# EAGLE design GPSClock (EAGLE 7.7.0)
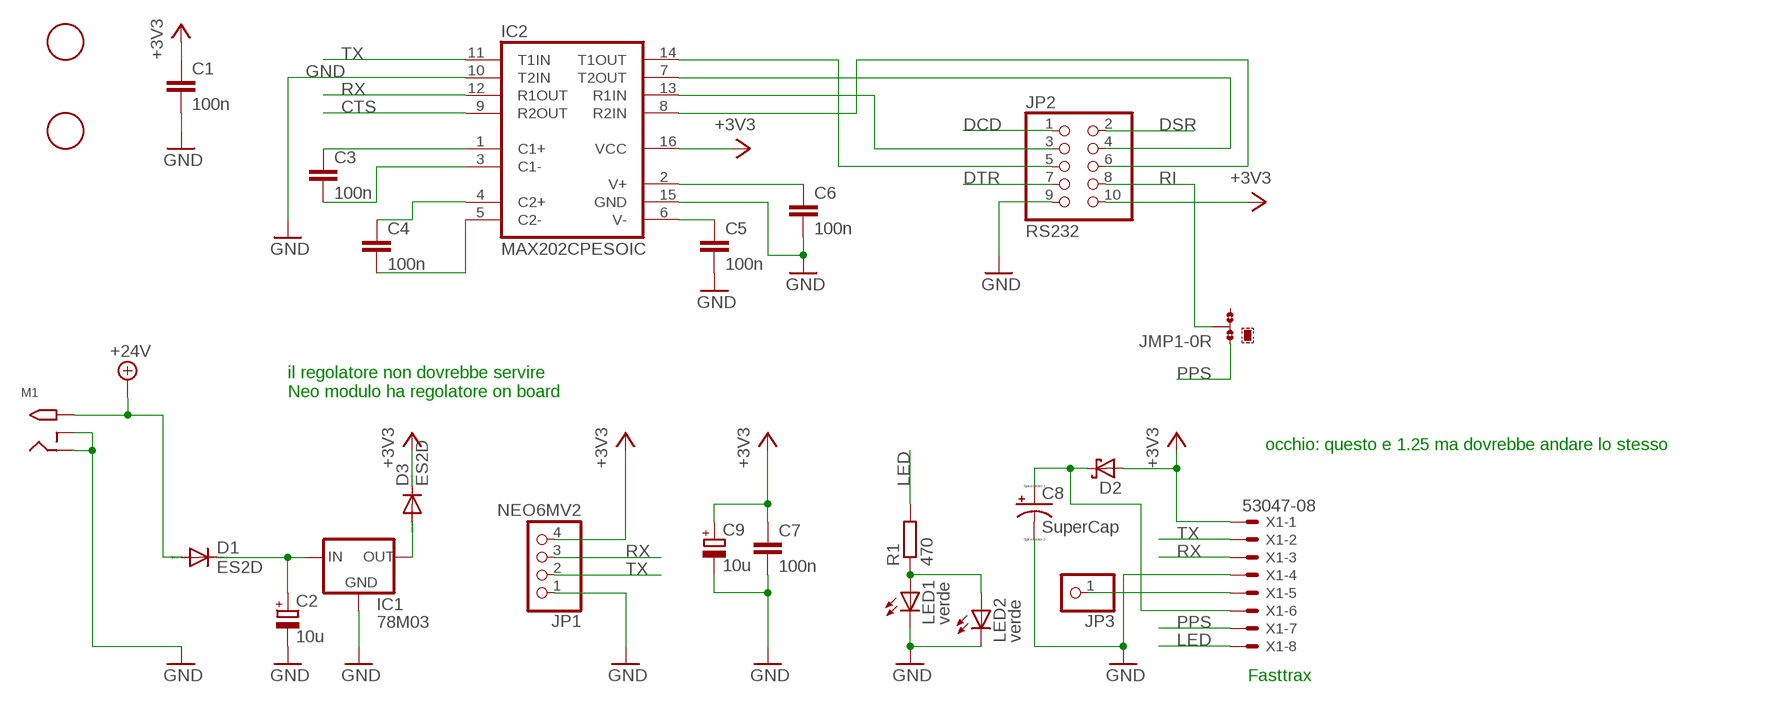
[diagram p0: schematic, sheet 1]

## Parts
C1  100n  C-EUC0805  [C0805]
C2  10u  CPOL-EUSMCD  [SMC_D]
C3  100n  C-EUC0805  [C0805]
C4  100n  C-EUC0805  [C0805]
C5  100n  C-EUC0805  [C0805]
C6  100n  C-EUC0805  [C0805]
C7  100n  C-EUC0805  [C0805]
C8  SuperCap  CPOL-USE10-22.5  [EB22,5D]
C9  10u  CPOL-EUSMCC  [SMC_C]
D1  ES2D  [SMB]
D2  SCHOTTKY-DIODESMC  [SMC]
D3  ES2D  [SMB]
F2  FIDUCIAL  [FIDUCIAL_1MM]
F3  FIDUCIAL  [FIDUCIAL_1MM]
IC1  78M03  78MXXSDPACK  [DPACK]
IC2  MAX202CPESOIC  [SO16]
JMP1  0R-JUMPC  [C0R-JMP]
JP1  NEO6MV2  PINHD-1X4  [1X04]
JP2  RS232  PINHD-2X05_2.54  [2X05]
JP3  PINHD-1X1  [1X01]
LED1  verde  LEDCHIPLED_0805  [CHIPLED_0805]
LED2  verde  LED3MM  [LED3MM]
M1  2.1MMJACKTHM  [PJ-102A]
R1  470  R-EU_R0805  [R0805]
X1  53047-08  [53047-08]

## Nets
+3V3 [+3V3]: C1.1 C7.1 C9.+ D2.A D3.C IC2.16(VCC) JP1.4 JP2.10 X1.1
+24V [+3V3]: D1.A M1.TIP
CTS: IC2.9(R2OUT)
DCD: JP2.1
DSR: JP2.2
DTR: JP2.7
GND [GND]: C1.2 C2.- C5.2 C6.2 C7.2 C8.- C9.- IC1.4(GND) IC2.10(T2IN) IC2.15(GND) JP1.1 JP2.9 LED1.C LED2.K(C) M1.RING M1.RING_SW X1.4
LED: R1.2 X1.8
N$1: JP3.1 X1.5
N$2: C3.1 IC2.1(C1+)
N$3 [+3V3]: D3.A IC1.3(OUT)
N$4: C3.2 IC2.3(C1-)
N$5 [+3V3]: C8.+ D2.C X1.6
N$6 [+3V3]: C2.+ D1.C IC1.1(IN)
N$9: LED1.A LED2.A R1.1
N$16: C4.1 IC2.4(C2+)
N$27: C4.2 IC2.5(C2-)
N$39: IC2.14(T1OUT) JP2.5
N$40: IC2.7(T2OUT) JP2.4
N$46: IC2.13(R1IN) JP2.3
N$47: IC2.8(R2IN) JP2.6
PPS: JMP1.1 X1.7
RI: JMP1.2 JP2.8
RX: IC2.12(R1OUT) JP1.3 X1.3
TX: IC2.11(T1IN) JP1.2 X1.2
V+: C6.1 IC2.2(V+)
V-: C5.1 IC2.6(V-)
Unconnected: JMP1.3

## Notes on the sheet
- il regolatore non dovrebbe servire
  Neo modulo ha regolatore on board
- occhio: questo e 1.25 ma dovrebbe andare lo stesso
- Fasttrax

## Library data of the parts
C1 C3-C7 = resistor:C-EU: CAPACITOR, European symbol
C2 C9 = resistor:CPOL-EU: POLARIZED CAPACITOR, European symbol
C8 = resistor:CPOL-US: POLARIZED CAPACITOR, American symbol
D1 D3 = diode:ES2D: DIODE super fast rectifier, 2 A
D2 = diode:SCHOTTKY-DIODE: Schottky Diode
F2 F3 = adafruit:FIDUCIAL: For use by pick and place machines to calibrate the vision/machine, 1mm By microbuilder.eu
IC1 = v-reg:78MXXS: VOLTAGE REGULATOR
IC2 = maxim:MAX202CPE: RS232 TRANSCEIVER
JMP1 = jump-0r-smd:0R-JUMP: SMD 0R 0805 Jumper
JP1 = pinhead:PINHD-1X4: PIN HEADER
JP2 = pinhead-2:PINHD-2X05: PIN HEADER
JP3 = pinhead:PINHD-1X1: PIN HEADER
LED1 = led:LED: LED
LED2 = adafruit:LED: LED
M1 = adafruit:2.1MMJACK: 2.1mm x 5.5mm THM DC jack with internal switch. Digikey part #PJ-102A, 4UCON part #05537 2.1mm x 5.5mm SMT DC jack with internal switch. Digikey part #PJ-002A-SMT, 4UCON part #03267 By microbuilder.eu & adafruit.com
R1 = resistor:R-EU_: RESISTOR, European symbol
X1 = con-molex:53?-08: CONNECTOR wire to board 1.25 mm (.049 inch) pitch header; MPN: 53047-0810; OC_FARNELL: 1012258; OC_NEWARK: 98K9826

## Net classes
1 +3V3: width 0.508 mm, clearance 0.152 mm
2 N2: width 0.762 mm, clearance 0.762 mm
3 N3: width 0.508 mm
4 GND: width 0.508 mm, clearance 0.152 mm

## Board
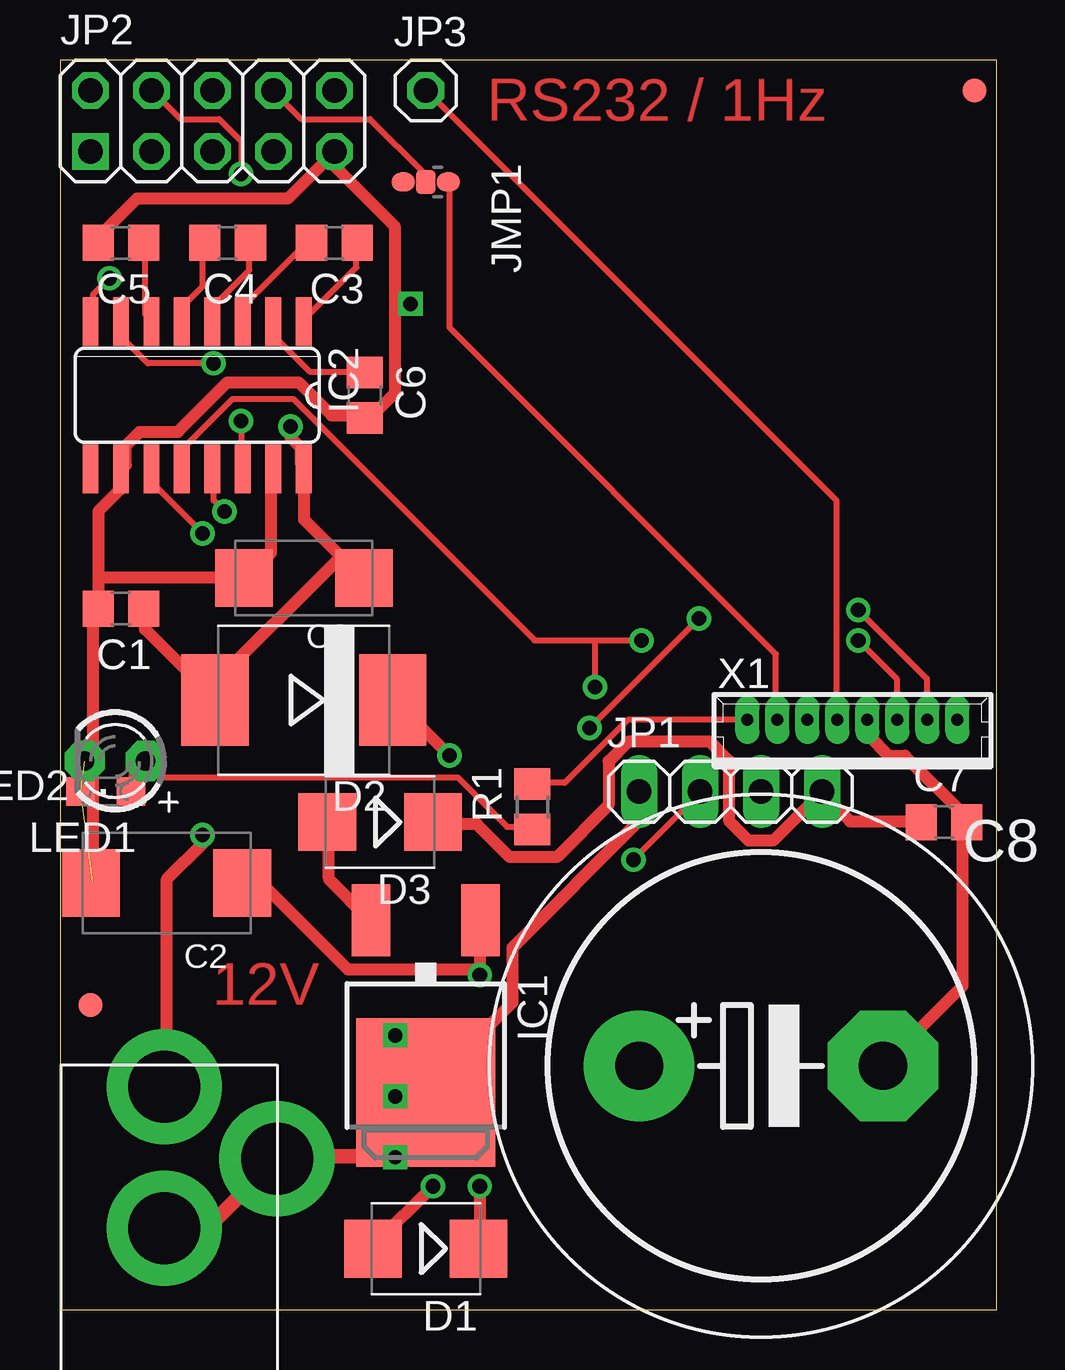
[diagram p1: board, top side]
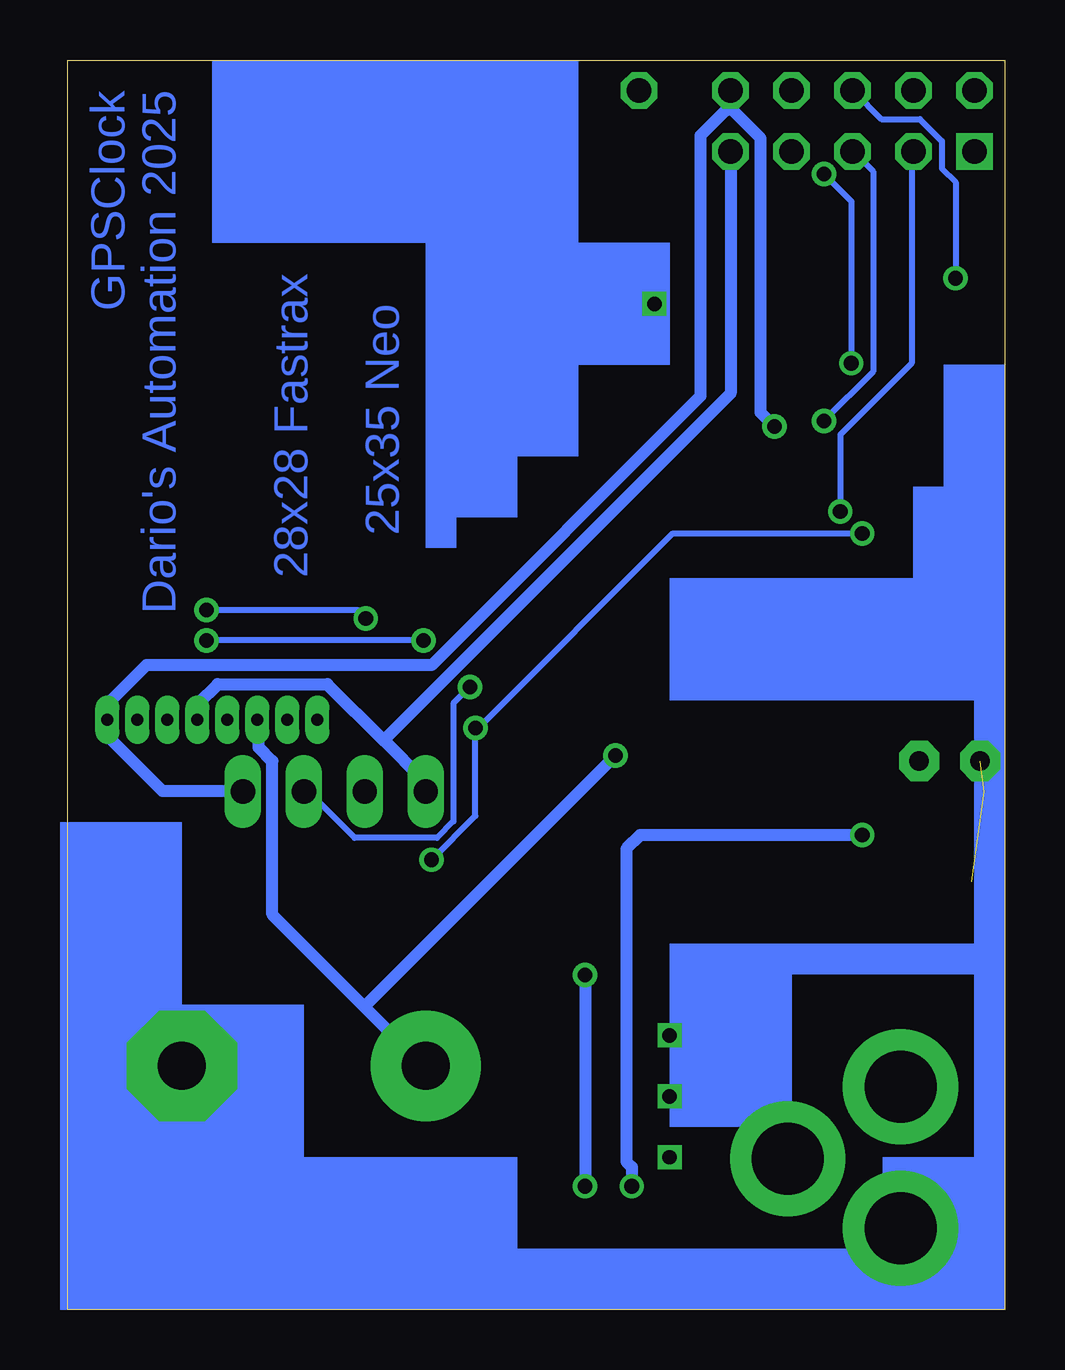
[diagram p2: board, bottom side, seen from below]

Size 39.04 x 52.06 mm. Coordinates in mm from the lower left corner, seen from the top.
Outline: 0,0 39.04,0 39.04,52.06 0,52.06 0,0
Copper layers (1*16): Top 0.035mm / dielectric 1.5mm / Bottom 0.035mm
Design rules "default": minimum track width 10mil, minimum drill 24mil, track to track 8mil, track to pad 8mil, pad to pad 8mil, via to via 8mil, smd to smd 8mil, copper to edge 40mil, drill to drill 8mil, minimum pad ring 10mil, minimum via ring 8mil, stop-mask expansion 4mil, vias tented up to drill 0mil, thermal gap 10mil

### Footprints (pad centres in the part's own frame; a part is rotated, then mirrored left to right if it is on the bottom)
C0805 = smd 1.3 x 1.5: 1 -0.95,0; 2 0.95,0
SMC_D = smd 2.4 x 2.8: + -3.15,0; - 3.15,0
EB22,5D = drill 2.007 pad 4.597: + -5.08,0 | drill 2.007 pad 4.597 octagon: - 5.08,0
SMC_C = smd 2.4 x 2.4: + -2.5,0; - 2.5,0
SMB = smd 2.4 x 2.4: A 2.2,0; C -2.2,0
SMC = smd 2.8 x 3.8: A 3.7,0; C -3.7,0
FIDUCIAL_1MM = smd 1 x 1: 1 0,0
DPACK = smd 1.6 x 3: 1 -2.28,-4.8; 3 2.28,-4.8 | smd 5.8 x 6.2: 4 0,2.38
SO16 = smd 0.66 x 2.032: 1 -4.445,-3.073; 2 -3.175,-3.073; 3 -1.905,-3.073; 4 -0.635,-3.073; 5 0.635,-3.073; 6 1.905,-3.073; 7 3.175,-3.073; 8 4.445,-3.073; 9 4.445,3.073; 10 3.175,3.073; 11 1.905,3.073; 12 0.635,3.073; 13 -0.635,3.073; 14 -1.905,3.073; 15 -3.175,3.073; 16 -4.445,3.073
C0R-JMP = smd 0.8 x 1: 1 0,0.938; 3 0,-0.938 | smd 1 x 0.8: 2 0,0
1X04 = drill 1.016 long: 1 -3.81,0; 2 -1.27,0; 3 1.27,0; 4 3.81,0
2X05 = drill 1.016 square: 1 -5.08,-1.27 | drill 1.016 octagon: 2 -5.08,1.27; 3 -2.54,-1.27; 4 -2.54,1.27; 5 0,-1.27; 6 0,1.27; 7 2.54,-1.27; 8 2.54,1.27; 9 5.08,-1.27; 10 5.08,1.27
1X01 = drill 1.016 octagon: 1 0,0
CHIPLED_0805 = smd 1.2 x 1.2: A 0,-1.05; C 0,1.05
LED3MM = drill 0.813 pad 1.676 octagon: A -1.27,0; K 1.27,0
PJ-102A = drill 3 pad 4.8: RING 0.1,-3.39; RING_SW -4.6,-6.29; TIP 0.1,-9.29
R0805 = smd 1.3 x 1.5: 1 -0.95,0; 2 0.95,0
53047-08 = drill 0.5 pad 0.698 long: 1 4.375,0.45; 2 3.125,0.45; 3 1.875,0.45; 4 0.625,0.45; 5 -0.625,0.45; 6 -1.875,0.45; 7 -3.125,0.45; 8 -4.375,0.45

### Placement (x,y rotation side)
C1  2.54,29.21 180 top
C2  4.45,17.78 180 top
C3  11.43,44.45 180 top
C4  6.99,44.45 180 top
C5  2.54,44.45 180 top
C6  12.7,38.1 270 top
C7  36.83,20.32 0 top
C8  29.21,10.16 0 top
C9  10.16,30.48 180 top
D1  15.24,2.54 180 top
D2  10.16,25.4 180 top
D3  13.34,20.32 180 top
F2  38.1,50.8 0 top
F3  1.27,12.7 0 top
IC1  15.24,11.43 180 top
IC2  5.71,38.1 180 top
JMP1  15.24,46.99 270 top
JP1  27.94,21.59 0 top
JP2  6.35,49.53 0 top
JP3  15.24,50.8 0 top
LED1  1.91,21.59 90 top
LED2  2.3,22.86 180 top
M1  4.45,0 180 top
R1  19.68,20.95 90 top
X1  33.02,24.13 0 top

### Tracks (layer width: path | path; a pad name or v marks a point on that pad's centre or on a via)
+3V3  (via drill 0.61)
  Top 0.508: C7.1 35.78,20.34 32.92,20.34 31.77,21.49 JP1.4 31.55,21.37 29.72,19.55 28.69,19.55 27.89,20.34 27.89,22.86 27.09,23.66 23.66,23.66 22.86,22.86 22.86,21.03 20.69,18.86 18.75,18.86 17.37,20.23 15.54,20.23 D3.C | C1.1 3.54,29.15 3.54,28.35 6.4,25.49 D2.A 6.29,25.95 11.54,31.2 C9.+ 12.57,30.52 10.17,32.92 10.17,34.98 IC2.16 10.06,35.2 10.06,35.89 9.6,36.35 v9.6,36.8
  Bottom 0.508: JP1.4 31.77,21.6 35.09,21.6 37.38,23.89 37.38,24.57 X1.1 37.26,24.8 37.26,25.38 35.78,26.86 23.89,26.86 12.69,38.06 12.69,48.92 11.66,49.95 11.43,50.06 | 11.43,50.06 JP2.10 | 11.43,50.06 10.17,48.81 10.17,37.38 v9.6,36.8
+24V  (via drill 0.61)
  Top 0.508: 13.03,2.52 D1.A 13.14,2.74 v15.54,5.14 | v5.94,19.77 5.94,19.43 4.46,17.95 4.46,9.37 M1.TIP
  Bottom 0.508: v15.54,5.14 15.54,5.94 15.77,6.17 15.77,19.2 15.2,19.77 v5.94,19.77
GND  (2 unrouted)
  Top 0.508: C5.2 1.6,44.46 1.6,44.69 3.2,46.29 9.49,46.29 11.43,48.23 JP2.9 11.32,47.78 13.95,45.15 13.95,38.18 13.03,37.26 12.8,37.26 C6.2 12.46,37.26 11.32,37.26 9.94,38.63 6.97,38.63 4.92,36.58 3.31,36.58 2.74,36.01 2.74,35.2 IC2.10 2.52,34.98 2.52,34.18 1.6,33.26 1.6,30.52 | IC2.15 8.8,34.98 8.8,31.55 7.77,30.52 C9.- 7.43,30.52 1.6,30.52 | 1.6,30.52 1.6,29.26 C1.2 1.37,29.15 1.37,17.83 C2.- 1.49,17.6 | X1.4 33.72,24.57 33.72,23.89 34.52,23.09 35.2,23.09 37.72,20.57 37.72,20.34 C7.2 37.6,20.12 37.6,13.49 34.29,10.17 C8.- | JP1.1 24.12,21.49 24.12,20.34 18.86,15.09 18.86,12.8 15.32,9.26 IC1.4 15.2,8.8 15.2,8.46 14.63,7.89 13.83,7.89 12.34,6.4 | 4.46,3.43 M1.RING | M1.RING_SW 9.26,6.4
  Top 0.61: 4.46,3.43 6.17,3.43 M1.RING_SW | 12.34,6.4 9.26,6.4
  Bottom 0.508: 25.89,23.72 28.23,26.06 32.8,26.06 33.6,25.26 33.6,24.69 X1.4 | 25.89,23.72 24.23,22.06 24.23,21.6 JP1.1 | 25.89,23.72 11.43,38.18 JP2.9
LED
  Top 0.254: R1.2 19.77,21.95 21.03,21.95 23.66,24.57 28.57,24.57 X1.8
N$1
  Top 0.254: X1.5 32.35,24.69 32.35,33.72 15.32,50.75 JP3.1
N$2
  Top 0.254: C3.1 12.34,44.35 12.34,43.43 10.17,41.26 IC2.1
N$3
  Top 0.508: D3.A 11.2,20.23 11.2,17.95 12.92,16.23 IC1.3
N$4
  Top 0.254: C3.2 10.4,44.35 10.17,44.35 7.66,41.83 7.66,41.26 IC2.3
N$5  (via drill 0.61)
  Top 0.508: v16.23,23.09 13.95,25.38 D2.C
  Bottom 0.508: 26.69,12.63 24.23,10.17 C8.+ | 26.69,12.63 30.52,16.46 30.52,22.86 31.09,23.43 31.09,24.57 X1.6 | 26.69,12.63 v16.23,23.09
N$6  (via drill 0.61)
  Top 0.508: v17.49,5.14 17.49,2.63 D1.C | IC1.1 17.49,16.12 v17.49,13.95 17.26,14.17 12,14.17 8.46,17.72 7.66,17.72 C2.+
  Bottom 0.508: v17.49,13.95 v17.49,5.14
N$7  (via drill 0.6)
  other vias: 13.97,11.43
N$8  (via drill 0.6)
  other vias: 13.97,8.89
N$9
  Top 0.254: LED1.A 2.97,21.6 2.97,22.29 3.54,22.86 LED2.A 3.66,22.86 4.34,22.17 16.57,22.17 18.63,20.12 19.66,20.12 R1.1
N$10  (via drill 0.6)
  other vias: 13.97,6.35
N$11  (via drill 0.6)
  other vias: 14.61,41.91
N$16
  Top 0.254: C4.1 7.89,44.35 7.89,43.32 6.4,41.83 6.4,41.26 IC2.4
N$27
  Top 0.254: C4.2 5.94,44.35 5.94,42.63 5.14,41.83 5.14,41.26 IC2.5
N$39  (via drill 0.61)
  Top 0.254: v7.54,37.03 7.54,35.09 IC2.14
  Bottom 0.254: v7.54,37.03 5.49,39.09 5.49,47.43 6.29,48.23 JP2.5
N$40  (via drill 0.61)
  Top 0.254: v6.4,39.43 3.66,39.43 2.63,40.46 2.63,41.15 IC2.7 | v7.54,47.32 7.54,48.69 6.63,49.61 5.03,49.61 3.89,50.75 JP2.4
  Bottom 0.254: v6.4,39.43 6.4,46.18 v7.54,47.32
N$46  (via drill 0.61)
  Top 0.254: v6.86,33.26 6.4,33.72 6.4,34.98 IC2.13
  Bottom 0.254: v6.86,33.26 6.86,36.46 3.89,39.43 3.89,48.23 JP2.3
N$47  (via drill 0.61)
  Top 0.254: v2.06,42.98 1.37,42.29 1.37,41.26 IC2.8
  Bottom 0.254: v2.06,42.98 2.06,46.98 2.63,47.55 2.63,48.69 3.54,49.61 5.14,49.61 6.29,50.75 JP2.6
PPS
  Top 0.254: JMP1.1 16.23,46.98 16.23,40.92 29.83,27.32 29.83,24.69 X1.7
RI
  Top 0.254: JMP1.2 15.2,47.09 15.2,47.32 12.92,49.61 10.06,49.61 8.91,50.75 JP2.8
RX  (via drill 0.61)
  Top 0.254: v33.26,27.89 34.86,26.29 34.86,24.69 X1.3 | 22.29,27.89 19.77,27.89 9.72,37.95 7.2,37.95 5.14,35.89 5.14,35.09 IC2.12 | 22.29,27.89 v24.23,27.89 | 22.29,27.89 v22.29,25.95
  Bottom 0.254: v24.23,27.89 v33.26,27.89 | v22.29,25.95 22.97,25.26 22.97,20.34 23.66,19.66 27.09,19.66 28.92,21.49 29.15,21.49 JP1.3
TX  (via drill 0.61)
  Top 0.254: v33.26,29.15 36.12,26.29 36.12,24.69 X1.2 | v22.06,24.23 v26.63,28.8 | v23.89,18.75 26.63,21.49 JP1.2 | v5.94,32.35 3.89,34.4 3.89,34.98 IC2.11
  Bottom 0.254: v33.26,29.15 26.98,29.15 v26.63,28.8 | v23.89,18.75 22.06,20.57 v22.06,24.23 21.95,24.23 13.83,32.35 v5.94,32.35
V+
  Top 0.254: C6.1 12.69,39.09 10.4,39.09 8.91,40.58 8.91,41.15 IC2.2
V-
  Top 0.254: C5.1 3.54,44.35 3.54,41.49 3.77,41.26 IC2.6
(copper drawn outside any net)
  shapes: Bottom area x19

### Text on the board
Top: RS232 / 1Hz | 12V
Bottom: GPSClock / Dario's Automation 2025 | 28x28 Fastrax | 25x35 Neo